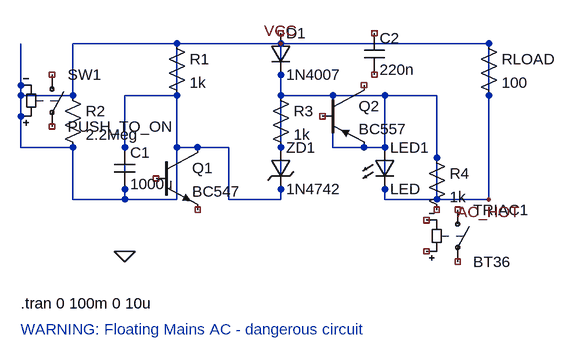
[diagram p0: schematic 15-triac-timer_generated-by-claude-sonnet-4-6.asc]
15-triac-timer_generated-by-claude-sonnet-4-6.asc, the LTspice schematic file:
Version 4
SHEET 1 880 680
WIRE 80 80 80 160
WIRE 80 160 160 160
WIRE 160 160 160 80
WIRE 160 80 320 80
WIRE 320 80 320 160
WIRE 80 160 80 240
WIRE 80 240 160 240
WIRE 160 240 160 320
WIRE 160 320 240 320
WIRE 240 160 240 320
WIRE 240 160 320 160
WIRE 320 160 320 240
WIRE 320 240 320 320
WIRE 320 320 240 320
WIRE 320 80 480 80
WIRE 480 80 480 160
WIRE 480 160 560 160
WIRE 480 160 480 240
WIRE 480 240 480 320
WIRE 480 320 400 320
WIRE 400 320 400 240
WIRE 400 240 320 240
WIRE 560 160 560 240
WIRE 560 240 640 240
WIRE 640 240 640 160
WIRE 640 160 560 160
WIRE 640 240 640 320
WIRE 640 320 720 320
WIRE 720 320 720 240
WIRE 720 240 720 160
WIRE 720 160 640 160
WIRE 720 320 800 320
WIRE 800 320 800 80
WIRE 800 80 480 80
FLAG 240 400 0
FLAG 480 80 VCC
FLAG 800 320 AC_HOT
SYMBOL res 144 144 R0
SYMATTR InstName R2
SYMATTR Value 2.2Meg
SYMBOL cap 224 240 R0
SYMATTR InstName C1
SYMATTR Value 1000u
SYMATTR SpiceLine IC=0
SYMBOL res 304 64 R0
SYMATTR InstName R1
SYMATTR Value 1k
SYMBOL npn 288 240 R0
SYMATTR InstName Q1
SYMATTR Value BC547
SYMBOL res 464 144 R0
SYMATTR InstName R3
SYMATTR Value 1k
SYMBOL pnp 544 144 R0
SYMATTR InstName Q2
SYMATTR Value BC557
SYMBOL diode 464 64 R0
SYMATTR InstName D1
SYMATTR Value 1N4007
SYMBOL zener 464 240 R0
SYMATTR InstName ZD1
SYMATTR Value 1N4742
SYMATTR SpiceLine Vz=12
SYMBOL cap 608 64 R0
SYMATTR InstName C2
SYMATTR Value 220n
SYMATTR SpiceLine V=400
SYMBOL led 624 240 R0
SYMATTR InstName LED1
SYMATTR Value LED
SYMBOL res 704 240 R0
SYMATTR InstName R4
SYMATTR Value 1k
SYMBOL sw 752 320 R0
SYMATTR InstName TRIAC1
SYMATTR Value BT36
SYMBOL res 784 64 R0
SYMATTR InstName RLOAD
SYMATTR Value 100
SYMBOL sw 128 112 R0
SYMATTR InstName SW1
SYMATTR Value PUSH_TO_ON
TEXT 80 480 Left 2 !.tran 0 100m 0 10u
TEXT 80 520 Left 2 ;WARNING: Floating Mains AC - dangerous circuit

The netlist it stands for:
* 15-triac-timer_generated-by-claude-sonnet-4-6.asc
R2 AC_HOT AC_HOT 2.2Meg
C1 AC_HOT AC_HOT 1000u IC=0
R1 AC_HOT AC_HOT 1k
Q1 AC_HOT NC_01 NC_02 0 BC547
R3 AC_HOT AC_HOT 1k
Q2 NC_03 NC_04 AC_HOT 0 BC557
D1 NC_05 AC_HOT 1N4007
D§ZD1 AC_HOT AC_HOT 1N4742 Vz=12
C2 NC_06 NC_07 220n V=400
D§LED1 AC_HOT AC_HOT LED
R4 AC_HOT NC_08 1k
S§TRIAC1 NC_09 NC_10 NC_11 NC_12 BT36
RLOAD AC_HOT AC_HOT 100
SW1 NC_13 NC_14 AC_HOT AC_HOT PUSH_TO_ON
.model D D
.lib standard.dio
.model NPN NPN
.model PNP PNP
.lib standard.bjt
.tran 0 100m 0 10u
* WARNING: Floating Mains AC - dangerous circuit
.backanno
.end